# Altium schematic sheet final schematic.SchDoc
size 762 x 457 mm; SheetNumber: 1; SheetTotal: 1
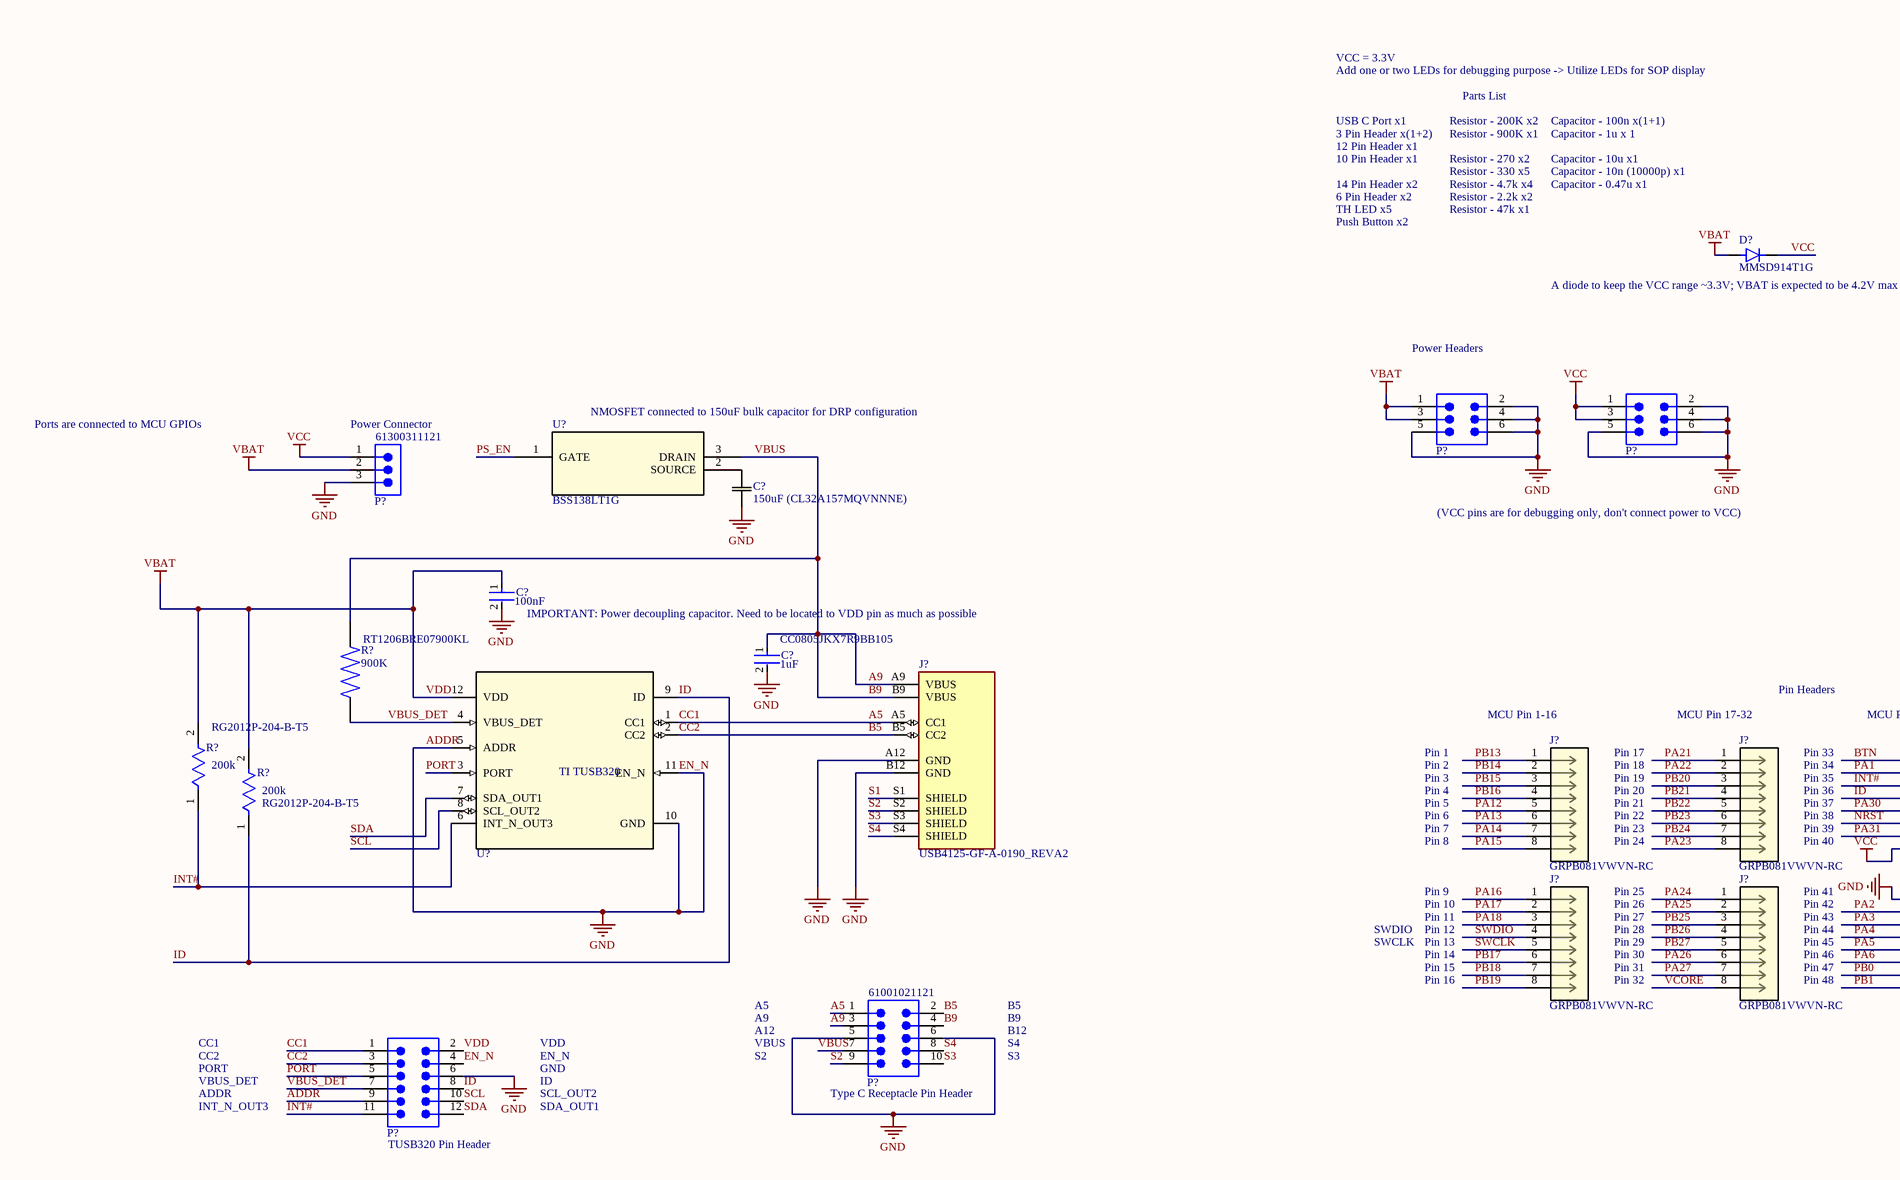
[diagram p0: final schematic.SchDoc, top left]
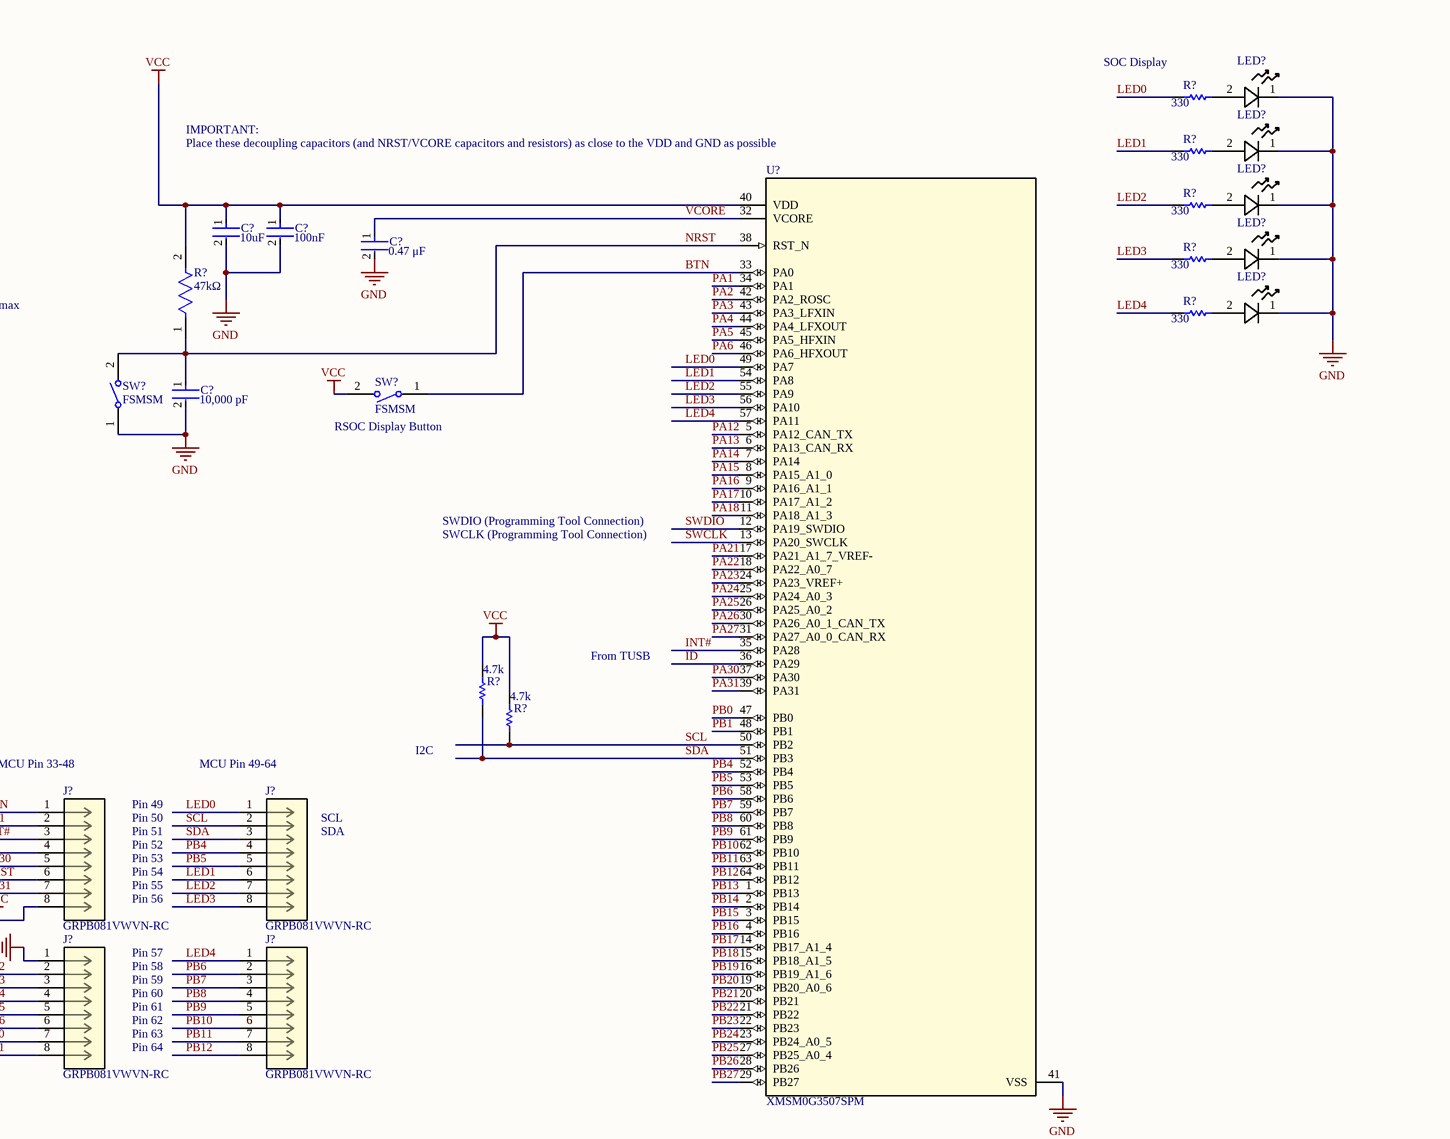
[diagram p1: final schematic.SchDoc, top right]
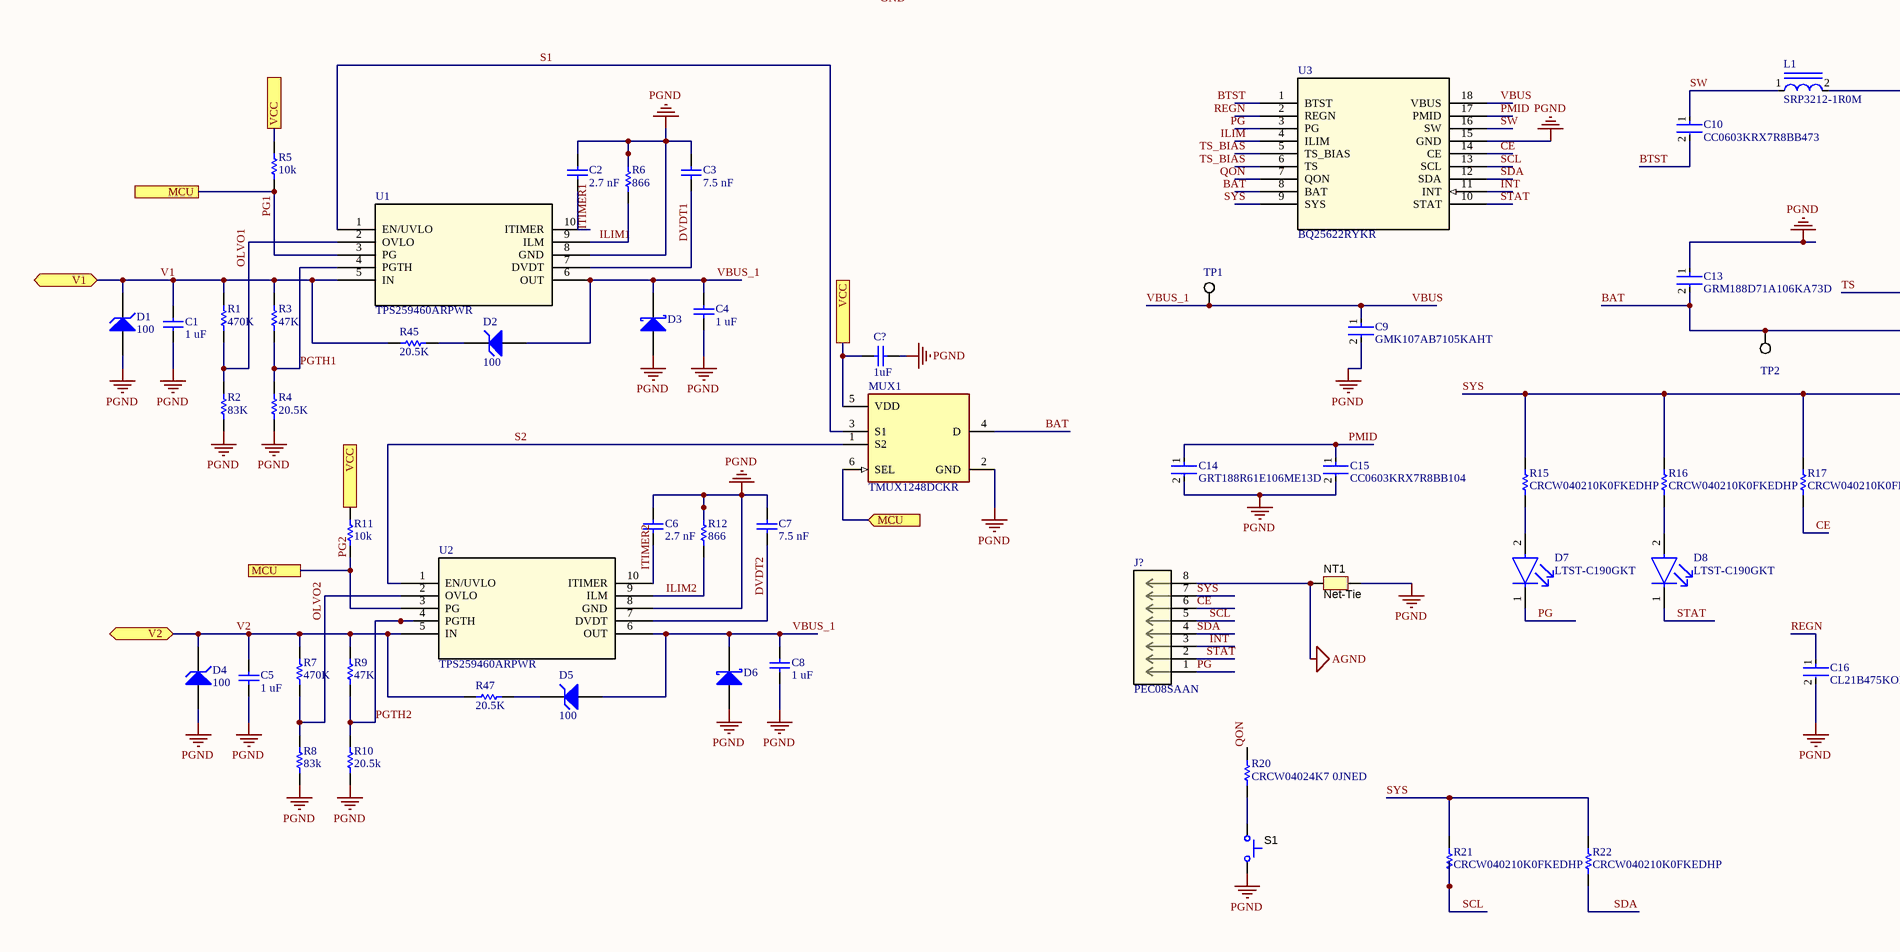
[diagram p2: final schematic.SchDoc, bottom left]
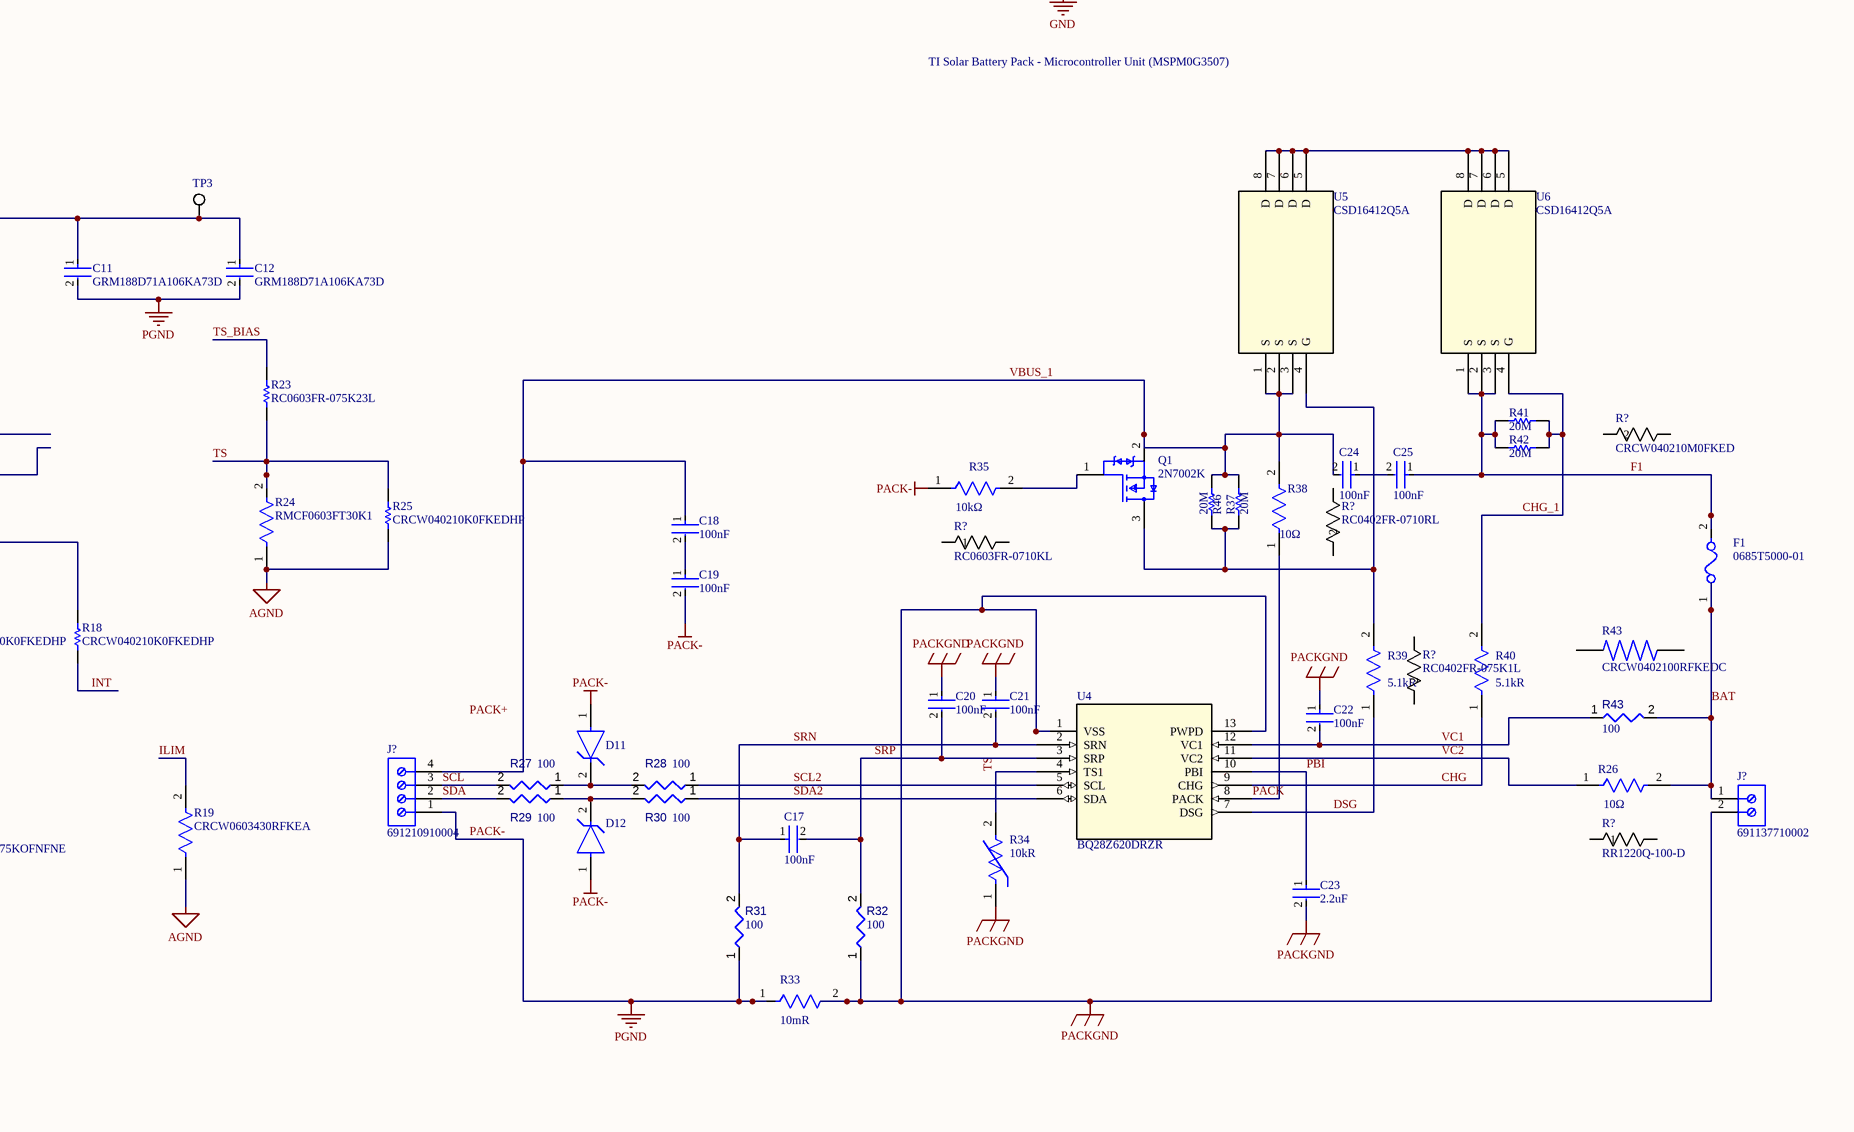
[diagram p3: final schematic.SchDoc, bottom right]

## Parts
(Parts that share a designator on the sheet are numbered #1, #2 ... from top to bottom, then left to right.)
C1  value 1 uF  (hidden comment: Capacitor)
C2  value 2.7 nF  (hidden comment: Capacitor)
C3  value 7.5 nF  (hidden comment: Capacitor)
C4  value 1 uF  (hidden comment: Capacitor)
C5  value 1 uF  (hidden comment: Capacitor)
C6  value 2.7 nF  (hidden comment: Capacitor)
C7  value 7.5 nF  (hidden comment: Capacitor)
C8  value 1 uF  (hidden comment: Capacitor)
C9  GMK107AB7105KAHT  [FP-0603-L_1_6_0_15-W_0_8-IPC_A]
C10  CC0603KRX7R8BB473  [FP-CC0603-DA-MFG]
C11  GRM188D71A106KA73D  [FP-GRM188-0_2-MFG]
C12  GRM188D71A106KA73D  [FP-GRM188-0_2-MFG]
C13  GRM188D71A106KA73D  [FP-GRM188-0_2-MFG]
C14  GRT188R61E106ME13D  [FP-GRT188-0_2-MFG]
C15  CC0603KRX7R8BB104  [FP-CC0603-DA-MFG]
C16  CL21B475KOFNFNE  [FP-CL21-IPC_B]
C17  Capacitance: 100nF  [FP-0805-L_2_01_0_2-W_1_25-IPC_C]  (hidden comment: 08055C104KAT2A)
C18  Capacitance: 100nF  [FP-0805-L_2_01_0_2-W_1_25-IPC_C]  (hidden comment: 08055C104KAT2A)
C19  Capacitance: 100nF  [FP-0805-L_2_01_0_2-W_1_25-IPC_C]  (hidden comment: 08055C104KAT2A)
C20  Capacitance: 100nF  [FP-0805-L_2_01_0_2-W_1_25-IPC_C]  (hidden comment: 08055C104KAT2A)
C21  Capacitance: 100nF  [FP-0805-L_2_01_0_2-W_1_25-IPC_C]  (hidden comment: 08055C104KAT2A)
C22  Capacitance: 100nF  [FP-0805-L_2_01_0_2-W_1_25-IPC_C]  (hidden comment: 08055C104KAT2A)
C23  Capacitance: 2.2uF  [FP-0805-L_2_01_0_2-W_1_25-IPC_B]  (hidden comment: 0805ZD225KAT2A)
C24  Capacitance: 100nF  [FP-0805-L_2_01_0_2-W_1_25-IPC_C]  (hidden comment: 08055C104KAT2A)
C25  Capacitance: 100nF  [FP-0805-L_2_01_0_2-W_1_25-IPC_C]  (hidden comment: 08055C104KAT2A)
C?#1  Capacitance: 10uF  [FP-C0805C106J8RACAUTO-MFG]  (hidden comment: C0805C106J8RACAUTO)
C?#2  Capacitance: 100nF  [FP-GRMJN6-0_1-MFG]  (hidden comment: GRMJN65C1H104GE01J)
C?#3  value 0.47 μF  [FP-C0603C-CF-MFG]  (hidden comment: C0603C474J4RACTU)
C?#4  value 10,000 pF  [FP-C0603C-CF-MFG]  (hidden comment: C0603C103J5RACTU)
C?#5  150uF (CL32A157MQVNNNE)  [CAP_CL32_SAM]
C?#6  Capacitance: 100nF  [FP-GRMJN6-0_1-MFG]  (hidden comment: GRMJN65C1H104GE01J)
C?#7  CC0805JKX7R9BB105  Capacitance: 1uF  [FP-CC0805-0_2-1_45-MFG]
C?#8  value 1uF  (hidden comment: Capacitor)
D1  BV: 100  (hidden comment: Zener Diode)
D2  BV: 100  (hidden comment: Zener Diode)
D3  Schottky Diode  (value not drawn)
D4  BV: 100  (hidden comment: Zener Diode)
D5  BV: 100  (hidden comment: Zener Diode)
D6  Schottky Diode  (value not drawn)
D7  LTST-C190GKT  [FP-LTST-C190GKT-MFG]
D8  LTST-C190GKT  [FP-LTST-C190GKT-MFG]
D11  MM3Z5V6C  [FP-SOD-323F-MFG]  (value not drawn)
D12  MM3Z5V6C  [FP-SOD-323F-MFG]  (value not drawn)
D?  MMSD914T1G  [DIO_MMSD914T1G]
F1  0685T5000-01  [FP-0685T-MFG]
J?#1  USB4125-GF-A-0190_REVA2  [GCT_USB4125-GF-A-0190_REVA2]
J?#2  GRPB081VWVN-RC  [CONN8_VWVN-RC_SUL]
J?#3  GRPB081VWVN-RC  [CONN8_VWVN-RC_SUL]
J?#4  GRPB081VWVN-RC  [CONN8_VWVN-RC_SUL]
J?#5  GRPB081VWVN-RC  [CONN8_VWVN-RC_SUL]
J?#6  GRPB081VWVN-RC  [CONN8_VWVN-RC_SUL]
J?#7  GRPB081VWVN-RC  [CONN8_VWVN-RC_SUL]
J?#8  GRPB081VWVN-RC  [CONN8_VWVN-RC_SUL]
J?#9  GRPB081VWVN-RC  [CONN8_VWVN-RC_SUL]
J?#10  691137710002  [691137710002]
J?#11  691210910004  [691210910004]
J?#12  PEC08SAAN  [CONN_xxC08SAAN_SUL]
L1  SRP3212-1R0M  [FP-SRP3212-MFG]
LED?#1  LTW-420D7  [LED_LTW-420D7_LTO]  (value not drawn)
LED?#2  LTW-420D7  [LED_LTW-420D7_LTO]  (value not drawn)
LED?#3  LTW-420D7  [LED_LTW-420D7_LTO]  (value not drawn)
LED?#4  LTW-420D7  [LED_LTW-420D7_LTO]  (value not drawn)
LED?#5  LTW-420D7  [LED_LTW-420D7_LTO]  (value not drawn)
MUX1  TMUX1248DCKR  [FP-DCK0006A-IPC_B]
NT1  Net-Tie  [Net-Tie_20milWide_60milLong]  (net tie, no BOM)
P?#1  61000621121  [61000621121]  (value not drawn)
P?#2  61000621121  [61000621121]  (value not drawn)
P?#3  61300311121  [61300311121]
P?#4  61001021121  [61001021121]
P?#5  61001221121  [61001221121]  (value not drawn)
Q1  2N7002K  [FP-318-08-MFG]
R1  value 470K  (hidden comment: Resistor)
R2  value 83K  (hidden comment: Resistor)
R3  value 47K  (hidden comment: Resistor)
R4  value 20.5K  (hidden comment: Resistor)
R5  value 10k  (hidden comment: Resistor)
R6  value 866  (hidden comment: Resistor)
R7  value 470K  (hidden comment: Resistor)
R8  value 83k  (hidden comment: Resistor)
R9  value 47K  (hidden comment: Resistor)
R10  value 20.5k  (hidden comment: Resistor)
R11  value 10k  (hidden comment: Resistor)
R12  value 866  (hidden comment: Resistor)
R15  CRCW040210K0FKEDHP  [RESC1005X40X25ML05T10]
R16  CRCW040210K0FKEDHP  [RESC1005X40X25ML05T10]
R17  CRCW040210K0FKEDHP  [RESC1005X40X25ML05T10]
R18  CRCW040210K0FKEDHP  [RESC1005X40X25ML05T10]
R19  CRCW0603430RFKEA  [FP-CRCW0603-e3-IPC_B]
R20  CRCW04024K7 0JNED  [RESC1005X40X25ML05T10]
R21  CRCW040210K0FKEDHP  [RESC1005X40X25ML05T10]
R22  CRCW040210K0FKEDHP  [RESC1005X40X25ML05T10]
R23  RC0603FR-075K23L  [RESC1608X55X25NL10T15]
R24  RMCF0603FT30K1  [FP-RMCF0603-IPC_A]
R25  CRCW040210K0FKEDHP  [RESC1005X40X25ML05T10]
R26  Resistance: 10Ω  [FP-PR01-MFG]  (hidden comment: PR01000101009JR500)
R27  value 100  [RESA60-630X240]  (hidden comment: MFR-25FBF52-100R)
R28  value 100  [RESA60-630X240]  (hidden comment: MFR-25FBF52-100R)
R29  value 100  [RESA60-630X240]  (hidden comment: MFR-25FBF52-100R)
R30  value 100  [RESA60-630X240]  (hidden comment: MFR-25FBF52-100R)
R31  value 100  [RESA60-630X240]  (hidden comment: MFR-25FBF52-100R)
R32  value 100  [RESA60-630X240]  (hidden comment: MFR-25FBF52-100R)
R33  Resistance: 10mR  [FP-ERJ8BW-MFG]  (hidden comment: ERJ-8BWFR010V)
R34  Resistance: 10kR  [FP-NCP21-0_2-IPC_C]  (hidden comment: NCP21XV103J03RA)
R35  Resistance: 10kΩ  [FP-MRS25-MFG]  (hidden comment: MRS25000C1002FCT00)
R37  20M  [RESC2013X60X35LL10T20]
R38  Resistance: 10Ω  [FP-PR01-MFG]  (hidden comment: PR01000101009JR500)
R39  Resistance: 5.1kR  [FP-MFR-12-MFG]  (hidden comment: MFR-12FTF52-5K1)
R40  Resistance: 5.1kR  [FP-MFR-12-MFG]  (hidden comment: MFR-12FTF52-5K1)
R41  20M  [RESC2013X60X35LL10T20]
R42  20M  [RESC2013X60X35LL10T20]
R43#1  CRCW0402100RFKEDC  [RESC1005X35N]
R43#2  value 100  [RESA60-630X240]  (hidden comment: MFR-25FBF52-100R)
R45  value 20.5K  (hidden comment: Resistor)
R46  20M  [RESC2013X60X35LL10T20]
R47  value 20.5K  (hidden comment: Resistor)
R?#1  value 330  [RESC2013X60X40LL20T25]  (hidden comment: ERA6AEB331V)
R?#2  value 330  [RESC2013X60X40LL20T25]  (hidden comment: ERA6AEB331V)
R?#3  value 330  [RESC2013X60X40LL20T25]  (hidden comment: ERA6AEB331V)
R?#4  value 330  [RESC2013X60X40LL20T25]  (hidden comment: ERA6AEB331V)
R?#5  value 330  [RESC2013X60X40LL20T25]  (hidden comment: ERA6AEB331V)
R?#6  Resistance: 47kΩ  [FP-ERA6A-MFG]  (hidden comment: ERA-6AEB473V)
R?#7  value 4.7k  [RESC2013X60X40ML20T25]  (hidden comment: ERA6AEB472V)
R?#8  RT1206BRE07900KL  value 900K  [RESC3116X65N]
R?#9  value 4.7k  [RESC2013X60X40ML20T25]  (hidden comment: ERA6AEB472V)
R?#10  RG2012P-204-B-T5  Resistance: 200k  [FP-RG2012-IPC_B]
R?#11  RG2012P-204-B-T5  Resistance: 200k  [FP-RG2012-IPC_B]
R?#12  CRCW040210M0FKED  [RES_CRCW_0402]
R?#13  RC0603FR-0710KL  [RC0603N_YAG]
R?#14  RC0402FR-0710RL  [RC0402N_YAG]
R?#15  RC0402FR-075K1L  [RC0402N_YAG]
R?#16  RR1220Q-100-D  [RES_1220_SUS]
S1  KSR221GLFS  [KSR]  (value not drawn)
SW?#1  FSMSM  [TECO-FSMSM-2_V]
SW?#2  FSMSM  [TECO-FSMSM-2_V]
TP1  5002  [Keystone5002]  (value not drawn)
TP2  5002  [Keystone5002]  (value not drawn)
TP3  5002  [Keystone5002]  (value not drawn)
U1  TPS259460ARPWR  [TPS259460ARPWR_TEX]
U2  TPS259460ARPWR  [TPS259460ARPWR_TEX]
U3  BQ25622RYKR  [WQFN-HR18__RYK_TEX]
U4  BQ28Z620DRZR  [VSON12_DRZ_TEX]
U5  CSD16412Q5A  [DQJ8]
U6  CSD16412Q5A  [DQJ8]
U?#1  XMSM0G3507SPM  [PM0064A-IPC_A]
U?#2  BSS138LT1G  [SOT-23-3_1P4X3P040_ONS]
U?#3  TI TUSB320  [RWB0012A]

## Ports
MCU (in, see final schematic[1C], final schematic[1D]), MCU (see final schematic[1C], final schematic[2D]), MCU (see final schematic[1D], final schematic[2D]), V1 (bidir), V2 (bidir), VCC (see final schematic[1C], final schematic[1D]), VCC (see final schematic[1C], final schematic[2C]), VCC (see final schematic[1D], final schematic[2C])

## Nets
ADDR: C?#1.2 C?#2.2 C?#3.2 C?#4.2 C?#5.1 C?#6.2 C?#7.2 J?#1.A12(GND) J?#1.B12(GND) J?#8.1 LED?#1.1 LED?#2.1 LED?#3.1 LED?#4.1 LED?#5.1 P?#1.2 P?#1.4 P?#1.5 P?#1.6 P?#2.2 P?#2.4 P?#2.5 P?#2.6 P?#3.3 P?#4.5 P?#4.6 P?#5.4 P?#5.6 P?#5.9 SW?#2.1 U?#1.41(VSS) U?#3.5(ADDR) U?#3.10(GND) U?#3.11(EN_N)  [also labelled EN_N, GND]
AGND: J?#12.8 NT1.1 R19.1 R24.1 R25.1
PACK-: C1.2 C2.1 C3.1 C4.2 C5.2 C6.1 C7.1 C8.2 C9.2 C11.2 C12.2 C13.1 C14.2 C15.2 C16.2 C19.2 C?#8.1 D1.1(A) D3.1(A) D4.1(A) D6.1(A) D11.1(A) D12.1(A) J?#11.1 MUX1.2(GND) NT1.2 R2.1 R4.1 R6.1 R8.1 R10.1 R12.1 R31.1 R33.1 R35.1 S1.2 U1.8(GND) U2.8(GND) U3.15(GND)  [also labelled PGND]
PACKGND: C20.1 C21.1 C22.1 C23.2 J?#10.2 R32.1 R33.2 R34.1 U4.1(VSS) U4.13(PWPD)
VCC: C?#1.1 C?#2.1 D?.K J?#4.8 P?#2.1 P?#2.3 P?#3.1 R?#6.2 R?#7.2 R?#9.2 SW?#1.2 U?#1.40(VDD)
VDD: C?#6.1 D?.A P?#1.1 P?#1.3 P?#3.2 P?#5.2 R?#10.2 R?#11.2 U?#3.12(VDD)  [also labelled VBAT]
A5: J?#1.A5(CC1) P?#4.1 P?#5.1 U?#3.1(CC1)  [also labelled CC1]
A9: C4.1 C8.1 C9.1 C18.1 C24.2 C?#7.1 D2.1(A) D3.2(K) D5.1(A) D6.2(K) J?#1.A9(VBUS) J?#1.B9(VBUS) J?#11.4 P?#4.3 P?#4.4 P?#4.7 Q1.2(Source) R37.2 R38.2 R46.2 R?#8.2 TP1.1 U1.6(OUT) U2.6(OUT) U3.18(VBUS) U5.1(S) U5.2(S) U5.3(S) U?#2.3(DRAIN)  [also labelled B9, VBUS, VBUS_1]
B5: J?#1.B5(CC2) P?#4.2 P?#5.3 U?#3.2(CC2)  [also labelled CC2]
BAT: C13.2 F1.1 J?#10.1 MUX1.4(D) R26.2 R43#2.2 TP2.1 U3.8(BAT)
BTN: J?#4.1 SW?#1.1 U?#1.33(PA0)
BTST: C10.2 U3.1(BTST)
CE: J?#12.6 R17.1 U3.14(CE)
CHG: R40.1 U4.9(CHG)
CHG_1: R40.2 R41.1 R42.1 U6.4(G)
DSG: R39.1 U4.7(DSG)
DVDT1: C3.2 U1.7(DVDT)
DVDT2: C7.2 U2.7(DVDT)
F1: C25.1 F1.2 R41.2 R42.2 U6.1(S) U6.2(S) U6.3(S)
ID: J?#4.4 P?#5.8 R?#11.1 U?#1.36(PA29) U?#3.9(ID)
ILIM: R19.2 U3.4(ILIM)
ILIM1: R6.2 U1.9(ILM)
ILIM2: R12.2 U2.9(ILM)
INT: J?#12.3 R18.1 U3.11(INT)
INT#: J?#4.3 P?#5.11 R?#10.1 U?#1.35(PA28) U?#3.6(INT_N_OUT3)
ITIMER1: C2.2 U1.10(ITIMER)
ITIMER2: C6.2 U2.10(ITIMER)
LED0: J?#5.1 R?#1.1 U?#1.49(PA7)
LED1: J?#5.6 R?#2.1 U?#1.54(PA8)
LED2: J?#5.7 R?#3.1 U?#1.55(PA9)
LED3: J?#5.8 R?#4.1 U?#1.56(PA10)
LED4: J?#9.1 R?#5.1 U?#1.57(PA11)
NRST: C?#4.1 J?#4.6 R?#6.1 SW?#2.2 U?#1.38(RST_N)
OLVO1: R1.1 R2.2 U1.2(OVLO)
OLVO2: R7.1 R8.2 U2.2(OVLO)
PA1: J?#4.2 U?#1.34(PA1)
PA2: J?#8.2 U?#1.42(PA2_ROSC)
PA3: J?#8.3 U?#1.43(PA3_LFXIN)
PA4: J?#8.4 U?#1.44(PA4_LFXOUT)
PA5: J?#8.5 U?#1.45(PA5_HFXIN)
PA6: J?#8.6 U?#1.46(PA6_HFXOUT)
PA12: J?#2.5 U?#1.5(PA12_CAN_TX)
PA13: J?#2.6 U?#1.6(PA13_CAN_RX)
PA14: J?#2.7 U?#1.7(PA14)
PA15: J?#2.8 U?#1.8(PA15_A1_0)
PA16: J?#6.1 U?#1.9(PA16_A1_1)
PA17: J?#6.2 U?#1.10(PA17_A1_2)
PA18: J?#6.3 U?#1.11(PA18_A1_3)
PA21: J?#3.1 U?#1.17(PA21_A1_7_VREF-)
PA22: J?#3.2 U?#1.18(PA22_A0_7)
PA23: J?#3.8 U?#1.24(PA23_VREF+)
PA24: J?#7.1 U?#1.25(PA24_A0_3)
PA25: J?#7.2 U?#1.26(PA25_A0_2)
PA26: J?#7.6 U?#1.30(PA26_A0_1_CAN_TX)
PA27: J?#7.7 U?#1.31(PA27_A0_0_CAN_RX)
PA30: J?#4.5 U?#1.37(PA30)
PA31: J?#4.7 U?#1.39(PA31)
PACK: R38.1 U4.8(PACK)
PB0: J?#8.7 U?#1.47(PB0)
PB1: J?#8.8 U?#1.48(PB1)
PB4: J?#5.4 U?#1.52(PB4)
PB5: J?#5.5 U?#1.53(PB5)
PB6: J?#9.2 U?#1.58(PB6)
PB7: J?#9.3 U?#1.59(PB7)
PB8: J?#9.4 U?#1.60(PB8)
PB9: J?#9.5 U?#1.61(PB9)
PB10: J?#9.6 U?#1.62(PB10)
PB11: J?#9.7 U?#1.63(PB11)
PB12: J?#9.8 U?#1.64(PB12)
PB13: J?#2.1 U?#1.1(PB13)
PB14: J?#2.2 U?#1.2(PB14)
PB15: J?#2.3 U?#1.3(PB15)
PB16: J?#2.4 U?#1.4(PB16)
PB17: J?#6.6 U?#1.14(PB17_A1_4)
PB18: J?#6.7 U?#1.15(PB18_A1_5)
PB19: J?#6.8 U?#1.16(PB19_A1_6)
PB20: J?#3.3 U?#1.19(PB20_A0_6)
PB21: J?#3.4 U?#1.20(PB21)
PB22: J?#3.5 U?#1.21(PB22)
PB23: J?#3.6 U?#1.22(PB23)
PB24: J?#3.7 U?#1.23(PB24_A0_5)
PB25: J?#7.3 U?#1.27(PB25_A0_4)
PB26: J?#7.4 U?#1.28(PB26)
PB27: J?#7.5 U?#1.29(PB27)
PBI: C23.1 U4.10(PBI)
PG: D7.1(C) J?#12.1 U3.3(PG)
PG1: MUX1.6(SEL) R5.2 R11.2 U1.3(PG) U2.3(PG) ; port MCU  [also labelled PG2]
PGTH1: R3.1 R4.2 U1.4(PGTH)
PGTH2: R9.1 R10.2 U2.4(PGTH)
PMID: C14.1 C15.1 U3.17(PMID)
PORT: P?#5.5 U?#3.3(PORT)
PS_EN: U?#2.1(GATE)
QON: R20.2 U3.7(QON)
REGN: C16.1 U3.2(REGN)
S1: J?#1.S1(SHIELD) MUX1.3(S1) U1.1(EN/UVLO)
S2: J?#1.S2(SHIELD) MUX1.1(S2) P?#4.9 U2.1(EN/UVLO)
S3: J?#1.S3(SHIELD) P?#4.10
S4: J?#1.S4(SHIELD) P?#4.8
SCL: J?#5.2 J?#11.3 J?#12.5 P?#5.10 R21.1 R27.2 R?#9.1 U3.13(SCL) U?#1.50(PB2) U?#3.8(SCL_OUT2)
SCL2: R28.1 U4.5(SCL)
SDA: J?#5.3 J?#11.2 J?#12.4 P?#5.12 R22.1 R29.2 R?#7.1 U3.12(SDA) U?#1.51(PB3) U?#3.7(SDA_OUT1)
SDA2: R30.1 U4.6(SDA)
SRN: C17.1 C21.2 R31.2 U4.2(SRN)
SRP: C17.2 C20.2 R32.2 U4.3(SRP)
STAT: D8.1(C) J?#12.2 U3.10(STAT)
SW: C10.1 L1.1 U3.16(SW)
SWCLK: J?#6.5 U?#1.13(PA20_SWCLK)
SWDIO: J?#6.4 U?#1.12(PA19_SWDIO)
SYS: J?#12.7 R15.2 R16.2 R17.2 R18.2 R21.2 R22.2 U3.9(SYS)
TS: R23.1 R24.2 R25.2 R34.2 U4.4(TS1)
TS_BIAS: R23.2 U3.5(TS_BIAS) U3.6(TS)
V1: C1.1 D1.2(K) R1.2 R3.2 R45.1 U1.5(IN) ; port V1
V2: C5.1 D4.2(K) R7.2 R9.2 R47.1 U2.5(IN) ; port V2
VBUS_DET: P?#5.7 R?#8.1 U?#3.4(VBUS_DET)
VC1: C22.2 R43#2.1 U4.12(VC1)
VC2: R26.1 U4.11(VC2)
VCC: C?#8.2 MUX1.5(VDD) R5.1 R11.1 ; port VCC  [a separate net that carries the same name]
VCORE: C?#3.1 J?#7.8 U?#1.32(VCORE)
NetC11_1: C11.1 C12.1 L1.2 TP3.1
NetC18_2: C18.2 C19.1
NetC24_1: C24.1 C25.2
NetC?#5_2: C?#5.2 U?#2.2(SOURCE)
NetD2_2: D2.2(K) R45.2
NetD5_2: D5.2(K) R47.2
NetD7_2: D7.2(A) R15.1
NetD8_2: D8.2(A) R16.1
NetD11_2: D11.2(C) R27.1 R28.2
NetD12_2: D12.2(C) R29.1 R30.2
NetLED?#1_2: LED?#1.2 R?#1.2
NetLED?#2_2: LED?#2.2 R?#2.2
NetLED?#3_2: LED?#3.2 R?#3.2
NetLED?#4_2: LED?#4.2 R?#4.2
NetLED?#5_2: LED?#5.2 R?#5.2
NetQ1_1: Q1.1(Gate) R35.2
NetQ1_3: Q1.3(Drain) R37.1 R39.2 R46.1 U5.4(G)
NetR20_1: R20.1 S1.1
NetU5_5: U5.5(D) U5.6(D) U5.7(D) U5.8(D) U6.5(D) U6.6(D) U6.7(D) U6.8(D)

Not connected (* = marked no-connect by the designer): R43#1 1 2; R?#12 1 2; R?#13 1 2; R?#14 1 2; R?#15 1 2; R?#16 1 2

## Notes on the sheet
- Add one or two LEDs for debugging purpose -> Utilize LEDs for SOP display
- VCC = 3.3V
- (near R?#1) SOC Display
- USB C Port x1
- 3 Pin Header x(1+2)
- 12 Pin Header x1
- Resistor - 200K x2
- Resistor - 900K x1
- Parts List
- Capacitor - 100n x(1+1)
- Capacitor - 1u x 1
- Place these decoupling capacitors (and NRST/VCORE capacitors and resistors) as close to the VDD and GND as possible
- IMPORTANT:
- 10 Pin Header x1
- 14 Pin Header x2
- 6 Pin Header x2
- TH LED x5
- Resistor - 270 x2
- Resistor - 330 x5
- Resistor - 4.7k x4
- Resistor - 2.2k x2
- Resistor - 47k x1
- Capacitor - 10u x1
- Capacitor - 10n (10000p) x1
- Capacitor - 0.47u x1
- Push Button x2
- (near D?) A diode to keep the VCC range ~3.3V; VBAT is expected to be 4.2V max
- Power Headers
- (near SW?#1) RSOC Display Button
- Ports are connected to MCU GPIOs
- (near P?#3) Power Connector
- (near U?#2) NMOSFET connected to 150uF bulk capacitor for DRP configuration
- (VCC pins are for debugging only, don't connect power to VCC)
- SWCLK (Programming Tool Connection)
- SWDIO (Programming Tool Connection)
- (near C?#6) IMPORTANT: Power decoupling capacitor. Need to be located to VDD pin as much as possible
- From TUSB
- (near J?#2) MCU Pin 1-16
- (near J?#3) MCU Pin 17-32
- Pin Headers
- (near J?#4) MCU Pin 33-48
- (near J?#5) MCU Pin 49-64
- I2C
- Pin 1
- Pin 2
- Pin 3
- Pin 17
- Pin 18
- Pin 19
- Pin 33
- Pin 34
- Pin 35
- Pin 49
- Pin 50
- Pin 51
- SCL
- SDA
- Pin 4
- Pin 5
- Pin 6
- Pin 7
- Pin 8
- Pin 20
- Pin 21
- Pin 22
- Pin 23
- Pin 24
- Pin 36
- Pin 37
- Pin 38
- Pin 39
- Pin 40
- Pin 52
- Pin 53
- Pin 54
- Pin 55
- Pin 56
- Pin 9
- Pin 10
- Pin 25
- Pin 26
- Pin 41
- Pin 42
- Pin 57
- Pin 58
- SWDIO
- SWCLK
- Pin 11
- Pin 12
- Pin 13
- Pin 14
- Pin 15
- Pin 27
- Pin 28
- Pin 29
- Pin 30
- Pin 31
- Pin 43
- Pin 44
- Pin 45
- Pin 46
- Pin 47
- Pin 59
- Pin 60
- Pin 61
- Pin 62
- Pin 63
- A5
- A9
- A12
- B5
- B9
- B12
- Pin 16
- Pin 32
- Pin 48
- Pin 64
- CC1
- CC2
- PORT
- VBUS_DET
- ADDR
- VDD
- EN_N
- GND
- ID
- SCL_OUT2
- VBUS
- S2
- (near P?#4) Type C Receptacle Pin Header
- S4
- S3
- TI Solar Battery Pack - Microcontroller Unit (MSPM0G3507)
- INT_N_OUT3
- (near P?#5) TUSB320 Pin Header
- SDA_OUT1
- Labels drawn without touching a wire or pin: PACK+

## Library data of the parts
C1-C8 C?#8 = Capacitor: SimulationGenericComponent: True
C9 = CMP-14477-000207-2: None; Dielectric: X7R; Voltage Rating: 35V; Capacitance: 1uF; Tolerance: 10%; Termination: SMD/SMT; Packaging: Tape and Reel; Case/Package: 0603; Ratings: AEC-Q200; Case Code (Metric): 1608; Height: 0.8mm; Halogen Free: Halogen Free; Lead Free: Lead Free; Min Operating Temperature: -55°C; Length: 1.6mm; RoHS Compliant: Yes; Case Code (Imperial): 0603; Thickness: 0.035inch; Width: 0.031inch; Max Operating Temperature: 125°C; Package Quantity: 4000; Voltage Rating (DC): 35V; Mount: Surface Mount
C10 = CMP-03422-000723-2: CAP CER 0.047UF 25V X7R 0603; NexarPartId: 9289253; Tolerance: 10%; Capacitance: 47nF; Material: Ceramic; Case/Package: 0603; RoHS: Compliant; Mount: Surface Mount; Length: 1.6mm; Dielectric: X7R; Schedule B: 8532240020, 8532240020; Halogen Free: Halogen Free; Case Code (Metric): 1608; Height: 800µm; Composition: Ceramic; Packaging: Digi-Reel®; Case Code (Imperial): 0603; Depth: 800µm; Max Operating Temperature: 125°C; Termination: SMD/SMT; Lead Free: Lead Free; Width: 800µm; Min Operating Temperature: -55°C; Voltage Rating: 25V; REACH SVHC: No SVHC; Voltage Rating (DC): 25V; Number of Pins: 2; Thickness: 889µm; Radiation Hardening: No
C11-C13 = CMP-06035-014971-1: Chip Multilayer Ceramic Capacitors for General Purpose, 0603, 10uF, X7T, +22%/-33%, 10%, 10V; Length: 1.6mm; Dielectric: X7T; Voltage Rating (DC): 10V; Width: 800um; Capacitance: 10uF; Thickness: 800um; Tolerance: 10%
C14 = CMP-06035-032378-1: Multi-Layer Ceramic Capacitor 10uF 25V X5R ±20% 0603 Paper T/R; Thickness: 0.035inch; Case/Package: 0603; Capacitance: 10uF; Voltage Rating: 25V; Mount: Surface Mount; Packaging: Tape and Reel; Width: 0.031inch; Max Operating Temperature: 85°C; Case Code (Imperial): 0603; Ratings: AEC-Q200; Tolerance: 20%; Min Operating Temperature: -55°C; Case Code (Metric): 1608; Length: 0.063inch
C15 = CMP-03422-000234-1: CAP CER 0.1UF 25V X7R 0603; Manufacturer: YAGEO; Capacitance: 100 nF; Tolerance: 0.1; Temperature Coefficient: 15%; Material: Ceramic; Value: 100 nF; Category: Cap; ComponentLink2URL: http://www.yageo.com/documents/recent/UPY-GPHC_X7R_6.3V-to-50V_18.pdf; Voltage Rating: 25 V; ComponentLink2Description: Datasheet; RoHS: TRUE; Octopart: https://octopart.com/cc0603krx7r8bb104-yageo-8376534; Manufacturer Part Number: CC0603KRX7R8BB104; Mouser Description: CC Series 0603 0.1 uF 25 V ±10% Tolerance X7R SMT Multilayer Ceramic Capacitor; Device Class L2: Capacitors; Automotive: No; Temperature Range Low: -55°C; Lead Free: Yes; Temperature Range High: +125°C; Package: CC0603-DA; Temperature: -55°C to +125°C; Footprint Url: http://www.yageo.com/exep/pages/download/literatures/UPY-C_GEN_24.pdf; Height: 0.9mm; Voltage: 25 V; Temperature Characteristic: X7R; Device Class L3: Ceramic Capacitors; Digikey Description: CAP CER 0.1UF 25V X7R 0603; Device Class L1: Passive Components
C16 = CMP-13271-000612-1: CL21 Series 0805 4.7uF 16V ±10% Tolerance X7R Multilayer Ceramic Chip Capacitor; Width: 0.049inch; Case Code (Imperial): 0805; Packaging: Tape and Reel; Package Quantity: 1; Max Operating Temperature: 125°C; Dielectric: X7R; Case Code (Metric): 2012; Capacitance: 4.7uF; Mount: Surface Mount; Radiation Hardening: No; Length: 0.079inch; Voltage Rating: 16V; Height: 1.25mm; Case/Package: 0805; Thickness: 0.053inch; Tolerance: 10%; Min Operating Temperature: -55°C; Depth: 1.25mm
C17-C22 C24 C25 = CMP-2000-05016-2: General Purpose Ceramic Capacitor, 0805, 100nF, 10%, X7R, 0.15, 50V; Dissipation Factor: 2.5%; Insulation Resistance: 100GR; Voltage Rating (DC): 50V; Package Quantity: 4000; Tolerance: 10%; Voltage Rating: 50V; Dielectric: X7R; Case/Package: 0805; Lead Free: Lead Free; Dielectric Material: Ceramic; Thickness: 0.037inch; Weight: 0.001411oz; Max Operating Temperature: 125°C; REACH SVHC: No SVHC; Mount: Surface Mount; RoHS Compliant: Yes; Depth: 1.25mm; Height: 0.5mm; Case Code (Metric): 2012; Length: 2mm; Termination: Standard; Case Code (Imperial): 0805; Number of Pins: 2; Voltage: 50V; Radiation Hardening: No; Min Operating Temperature: -55°C; Width: 1.2mm; Series: MLCC X7R; Packaging: Cut Tape
C23 = CMP-2000-05810-2: General Purpose Ceramic Capacitor, 0805, 2.2uF, 10%, X5R, 15%, 10V; Insulation Resistance: 500MR; Dissipation Factor: 5%; Termination: SMD/SMT; Length: 2.01mm; Lead Free: Lead Free; Voltage: 10V; Height: 1.4mm; Contact Plating: Tin; Dielectric: X5R; Voltage Rating (DC): 10V; REACH SVHC: No SVHC; Voltage Rating: 10V; Depth: 1.25mm; Min Operating Temperature: -55°C; Tolerance: 10%; Case Code (Metric): 2012; Max Operating Temperature: 85°C; Radiation Hardening: No; Dielectric Material: Ceramic; Packaging: Tape and Reel; Construction: Flat; Case Code (Imperial): 0805; RoHS Compliant: Yes; Package Quantity: 1; Series: -; Size: 1.4mm; Number of Pins: 2; Width: 0.049inch; Mount: Surface Mount; Thickness: 0.055inch; Case/Package: 0805
C?#1 = CMP-03020-034708-1: CAP CER 10UF 10V X7R 0805; Tolerance: 5%; Mount: Surface Mount; Voltage Rating: 10V; Max Operating Temperature: 125°C; Min Operating Temperature: -55°C; Case/Package: 0805; RoHS Compliant: Yes; Packaging: Tape and Reel; Case Code (Imperial): 0805; Case Code (Metric): 2012; Ratings: AEC-Q200
C?#2 C?#6 = CMP-00260-135708738-1: GRMJN65C1H104GE01J Multilayer Ceramic Capacitor, 0.1 uF, 50 V, ± 2%, C0G (NP0), 0704 [1810 Metric]; Voltage Rating: 50V; Temperature Coefficient: 30ppm/°C; Material: Ceramic; Tolerance: 2%; Case/Package: 0704; NexarPartId: 135708738; Height: 650µm; Lifecycle Status: Production; Min Operating Temperature: -55°C; Max Operating Temperature: 125°C
C?#3 = CMP-1035-02699-3: CAP CER 0.47UF 16V X7R 0603; Manufacturer: KEMET; Tolerance: 0.05; Temperature Coefficient: 30ppm/°C; Material: Ceramic; Automotive Grade: Grade 1; Manufacturer Part Number: C0603C474J4RACTU; Lead Free: Yes; Temperature Range Low: -55°C; Height: 0.87mm; Automotive: Yes; Device Class L2: Capacitors; Temperature Characteristic: X7R; Capacitance: 0.47 μF; Octopart: https://octopart.com/c0603c474j4ractu-kemet-15711632; Temperature Range High: +125°C; Temperature: -55°C to +125°C; Voltage Rating: 16 V; Device Class L1: Passive Components; ComponentLink2URL: https://api.kemet.com/component-edge/download/datasheet/C0603C100J5GACAUTO.pdf; Device Class L3: Ceramic Capacitors; Digikey Description: CAP CER 0.47UF 16V X7R 0603; Category: Cap; ComponentLink2Description: Datasheet; RoHS: TRUE; Mouser Description: Multilayer Ceramic Capacitors MLCC - SMD/SMT .47UF 16V 5% 0603; Package: C0603C-CF
C?#4 = CMP-2006-03817-3: Capacitor; Ceramic; Cap; .010uF; Tol 5%; SMT; Vol-Rtg 50V; X7R; Tape and Reel; Manufacturer: KEMET; Automotive Grade: Grade 1; Temperature Coefficient: 30ppm/°C; Tolerance: 0.05; Device Class L1: Passive Components; Temperature Range High: +125°C; Lead Free: Yes; Digikey Description: Capacitor; Ceramic; Cap; .010uF; Tol 5%; SMT; Vol-Rtg 50V; X7R; Tape and Reel; Temperature Range Low: -55°C; Voltage Rating: 50 V; Device Class L2: Capacitors; Octopart: https://octopart.com/c0603c103j5ractu-kemet-91371; ComponentLink2URL: https://api.kemet.com/component-edge/download/datasheet/C0603C100J5GACAUTO.pdf; Temperature Characteristic: X7R; Height: 0.87mm; ComponentLink2Description: Datasheet; Category: Cap; Manufacturer Part Number: C0603C103J5RACTU; Temperature: -55°C to +125°C; Device Class L3: Ceramic Capacitors; Mouser Description: Capacitor; Ceramic; Cap; .010uF; Tol 5%; SMT; Vol-Rtg 50V; X7R; Tape and Reel; RoHS: TRUE; Package: C0603C-CF; Automotive: Yes; Material: Ceramic; Capacitance: 10,000 pF
C?#5 = CL32A157MQVNNNE: No Description Available; Mfr_Name: Samsung
C?#7 = CMP-03422-001528-1: CAP CER 1UF 50V X7R 0805; Tolerance: 5%; Max Operating Temperature: 125°C; Case/Package: 0805; Packaging: Cut Tape; Voltage Rating: 50V; Mount: Surface Mount; Case Code (Metric): 2012; Case Code (Imperial): 0805; Min Operating Temperature: -55°C
D1 D2 D4 D5 = Zener Diode: AF: 1; BV_MAX: 1e99; CJO: 0; EG: 1.11; FC: 0.5; IBV: 0.001; IS: 1e-14; MJSW: 0.33; NTUN: 30; TNOM: 27; XTI: 3; SimulationGenericComponent: True; CJP: 0; CTA: 0; CTP: 0; FCS: 0.5; FV_MAX: 1e99; IKF: 0; IKR: 0; ISR: 1e-14; JSW: 0; JTUN: 0; JTUNSW: 0; KEG: 1; KF: 0; LEVEL: 1; N: 1; NBV: 1; NR: 1; NS: 1; PHP: 1; RS: 0; TCV: 0; TLEV: 0; TLEVC: 0; TM1: 0; TM2: 0; TPB: 0; TPHP: 0; TRS: 0; TRS2: 0; TT: 0; TTT1: 0; TTT2: 0; VJ: 1; XTITUN: 3
D3 D6 = Schottky Diode: AF: 1; BV: 0; BV_MAX: 1e99; EG: 1.11; FC: 0.5; IBV: 0.001; IS: 1e-14; MJSW: 0.33; NTUN: 30; TNOM: 27; XTI: 3; SimulationGenericComponent: True; CJO: 0; CJP: 0; CTA: 0; CTP: 0; FCS: 0.5; FV_MAX: 1e99; IKF: 0; IKR: 0; ISR: 1e-14; JSW: 0; JTUN: 0; JTUNSW: 0; KEG: 1; KF: 0; LEVEL: 1; N: 1; NBV: 1; NR: 1; NS: 1; PHP: 1; RS: 0; TCV: 0; TLEV: 0; TLEVC: 0; TM1: 0; TM2: 0; TPB: 0; TPHP: 0; TRS: 0; TRS2: 0; TT: 0; TTT1: 0; TTT2: 0; VJ: 1; XTITUN: 3
D7 D8 = CMP-22017-000005-2: LED GREEN CLEAR CHIP SMD; Dominant Wavelength: 569nm; Reverse Voltage: 5V; Lens Color: Colorless; Viewing Angle: 130°; Voltage: 2V; Forward Current: 30mA; Power Dissipation: 100mW; Luminous Intensity: 6mcd; Number of LEDs: 1; Forward Voltage: 2.1V; Wavelength: 565nm; Test Current: 10mA; Min Operating Temperature: -55°C; Lens Style: Clear; Mount: Surface Mount; Width: 0.8mm; Packaging: Tape and Reel; Lens Transparency: Clear; Case Code (Metric): 1608; Depth: 0.8mm; Case Code (Imperial): 0603; Case/Package: 0603; Number of Pins: 2; Max Operating Temperature: 85°C; Lead Free: Lead Free; Number of Elements: 1; Length: 1.6mm; Height: 0.8mm; Package Quantity: 1; Power Rating: 100mW; Radiation Hardening: No; Illumination Color: Green; Color: Green
D11 D12 = CMP-07164-000002-1: DIODE ZENER 5.6V 200MW SOD323F; Manufacturer: ON Semiconductor; Max Junction Temp: +150°C; Max Zener Voltage: 5.88V; Max Reverse Leakage Current: 0.9uA; Reverse Voltage: 2V; Zener Impedance: 37Ω; Device Class L2: Diodes; ComponentLink2Description: Datasheet; RoHS: TRUE; Digikey Description: DIODE ZENER 5.6V 200MW SOD323F; Mouser Description: Zener Diodes Diode Zener 5.6V 200mW 5%; ComponentLink2URL: https://www.onsemi.com/pub/Collateral/MM3Z9V1C-D.pdf; Octopart: https://octopart.com/mm3z5v6c-on+semiconductor-84329899; Category: Diode; Package: SOD-323F; Height: 1mm; Lead Free: Yes; Power Dissipation: 200mW; Temperature Range High: +150°C; Device Class L3: Zener Diodes; Automotive: No; Manufacturer Part Number: MM3Z5V6C; Nom Zener Voltage: 5.6V; Temperature: to +150°C; Device Class L1: Discrete Semiconductors
D? = MMSD914T1G: Diode Standard 100 V 200mA (DC) Surface Mount SOD-123; MF: ON Semiconductor; SnapEDA_Link: https://www.snapeda.com/parts/MMSD914T1G/Onsemi/view-part/?ref=snap; Package: SOD-123-2 ON Semiconductor; Value: *; MP: MMSD914T1G; Check_prices: https://www.snapeda.com/parts/MMSD914T1G/Onsemi/view-part/?ref=eda
F1 = CMP-16042-000006-1: FUSE BOARD MNT 5A 63VAC/VDC 1206; RoHS Compliant: Yes
J?#1 = USB4125-GF-A-0190_REVA2: Type C Receptacle, Horizontal, SMT, For Power Charging Only; MF: Global Connector Technology; Price: None; Check_prices: https://www.snapeda.com/parts/USB4125-GF-A-0190/Global%20Connector%20Technology/view-part/6227012/?ref=eda; Package: None; Value: *; MP: USB4125-GF-A-0190; SnapEDA_Link: https://www.snapeda.com/parts/USB4125-GF-A-0190/Global%20Connector%20Technology/view-part/6227012/?ref=snap; Availability: No availability data
J?#2-J?#9 = GRPB081VWVN-RC: No Description Available; Mfr_Name: Sullins; RefDes: RefDes; Type: Type
J?#10 = CMP-1502-03324-2: NexarPartId: 78871135; Voltage Rating: 300V; Number of Contacts: 2; Current Rating: 16A; Lead Pitch: 5mm; Height: 11.6mm; Packaging: Box; RoHS: Non-Compliant; Contact Material: Nickel, Tin; Max Operating Temperature: 120°C; Number of Pins: 2; Min Operating Temperature: -30°C; Number of Rows: 1
J?#11 = CMP-1502-02458-2: NexarPartId: 105950651
J?#12 = PEC08SAAN: No Description Available; Mfr_Name: Sullins; Type: Headers, Male Pins; RefDes: RefDes
L1 = CMP-07248-000145-1: IND,3.2X2.5X1MM,1UH20%,5.5A,SHD
LED?#1-LED?#5 = LTW-420D7: No Description Available; Mfr_Name: LITE-ON
MUX1 = CMP-04892-000117-1: 3- LOW RON, 5-V, 2:1 (SPDT) GENE
NT1 = CMP-0078142-6: Single point connection between nets.; MountType: SMT; CompType: Net-Tie; Manufacturer: N/A; PackageReference: N/A; PartNumber: N/A; Library Reference: Net-Tie
P?#1 P?#2 = 61000621121: WR-PHD Pin Header, SMT, Vertical, pitch 2.54mm, 2 Row, 6P; Manufacturer: Wurth Elektronik; Contact Resistance: 20mOhm; Rated Current: 3A; Working Voltage: 250V; Withstanding Voltage: 500V; Manufacturer Part Number: 61000621121; Category: Board-to-Board Connectors; Match Code: WR-PHD; ComponentLink1Description: Website Link; ComponentLink1URL: https://www.we-online.com/redexpert/article/61000621121?ad; ComponentLink2Description: Datasheet Link; ComponentLink2URL: https://www.we-online.com/redexpert/spec/61000621121?ad; Mount: Surface Mount; Operating Temperature Max: 125°C; Operating Temperature Min: -40°C; Packaging: Tube; Gender: Pin Header; Number of Pins: 6; Number of Rows: 2; Orientation: Vertical; Pitch: 2.54mm
P?#3 = 61300311121: WR-PHD Pin Header, THT, Vertical, pitch 2.54mm, 1 Row, 3P; Manufacturer: Wurth Elektronik; Contact Resistance: 20mOhm; Rated Current: 3A; Working Voltage: 250V; Withstanding Voltage: 500V; Manufacturer Part Number: 61300311121; Category: Board-to-Board Connectors; Match Code: WR-PHD; ComponentLink1Description: Website Link; ComponentLink1URL: https://www.we-online.com/redexpert/article/61300311121?ad; ComponentLink2Description: Datasheet Link; ComponentLink2URL: https://www.we-online.com/redexpert/spec/61300311121?ad; Mount: Through Hole; Operating Temperature Max: 105°C; Operating Temperature Min: -40°C; Packaging: Bag; Gender: Pin Header; Number of Pins: 3; Number of Rows: 1; Orientation: Vertical; Pitch: 2.54mm
P?#4 = 61001021121: WR-PHD Pin Header, SMT, Vertical, pitch 2.54mm, 2 Row, 10P; Manufacturer: Wurth Elektronik; Contact Resistance: 20mOhm; Rated Current: 3A; Working Voltage: 250V; Withstanding Voltage: 500V; Manufacturer Part Number: 61001021121; Category: Board-to-Board Connectors; Match Code: WR-PHD; ComponentLink1Description: Website Link; ComponentLink1URL: https://www.we-online.com/redexpert/article/61001021121?ad; ComponentLink2Description: Datasheet Link; ComponentLink2URL: https://www.we-online.com/redexpert/spec/61001021121?ad; Mount: Surface Mount; Operating Temperature Max: 125°C; Operating Temperature Min: -40°C; Packaging: Tube; Gender: Pin Header; Number of Pins: 10; Number of Rows: 2; Orientation: Vertical; Pitch: 2.54mm
P?#5 = 61001221121: WR-PHD Pin Header, SMT, Vertical, pitch 2.54mm, 2 Row, 12P; Manufacturer: Wurth Elektronik; Contact Resistance: 20mOhm; Rated Current: 3A; Working Voltage: 250V; Withstanding Voltage: 500V; Manufacturer Part Number: 61001221121; Category: Board-to-Board Connectors; Match Code: WR-PHD; ComponentLink1Description: Website Link; ComponentLink1URL: https://www.we-online.com/redexpert/article/61001221121?ad; ComponentLink2Description: Datasheet Link; ComponentLink2URL: https://www.we-online.com/redexpert/spec/61001221121?ad; Mount: Surface Mount; Operating Temperature Max: 125°C; Operating Temperature Min: -40°C; Packaging: Tube; Gender: Pin Header; Number of Pins: 12; Number of Rows: 2; Orientation: Vertical; Pitch: 2.54mm
Q1 = CMP-07173-000009-1: MOSFET N-CH 60V 300MA SOT23; Manufacturer: ON Semiconductor; Turn Off Delay Time: 55.8ns; Max Forward Diode Voltage: 1.2V; Max Junction Temp: +150°C; Pulse Drain Current: 5A; Threshold Vgs Min: 1V; Depletion Mode: False; Drain To Source Resistance: 1.19Ω; Number Of N Channels: 1; Standoff Height: 0.01mm; Rthja Max: 417°C/W; Input Capacitace At Vds: 24.5pF @ 20V; Threshold Vgs Max: 2.3V; Turn On Delay Time: 12.2ns; Gate Charge At Vgs: 0.7nC @ 4.5V; Continuous Drain Current: 320mA; Transconductance: 0.53S; Power Dissipation: 300mW; Gate To Source Voltage: 20V; Typ Forward Diode Voltage: 0.8V; ComponentLink2URL: https://www.onsemi.com/pub/Collateral/2N7002K-D.pdf; RoHS: TRUE; Device Class L1: Discrete Semiconductors; ComponentLink2Description: Datasheet; Manufacturer Part Number: 2N7002K; Octopart: https://octopart.com/2n7002k-on+semiconductor-84408900; Device Class L3: MOSFETs; Mouser Description: N-Channel 60 V 2 Ohm SMT Enhancement Mode Field Effect Transistor SOT-23; Ipc Land Pattern Name: SOT95P240X100-3; Temperature Range High: +150°C; Temperature Range Low: -55°C; Lead Free: Yes; Height: 1.11mm; Package: 318-08; Footprint Url: https://www.onsemi.com/pub/Collateral/318-08.PDF; Temperature: -55°C to +150°C; Drain To Source Voltage: 60V; Device Class L2: Transistors; Drain To Source Breakdown Voltage: 60V; Digikey Description: MOSFET N-CH 60V 300MA SOT23; Number Of Channels: 1; Category: Trans; Automotive: No
R1-R12 R45 R47 = Resistor: TC1: 0; SimulationGenericComponent: True; TC2: 0
R15-R18 R21 R22 R25 = CMP-2002-03043-1: Manufacturer: Vishay Dale; Part Number: CRCW040210K0FKEDHP
R19 = CMP-1012-00468-3: RES Thick Film, 430Ω, 1%, 0.1W, 100ppm/°C, 0603; Power Rating: 100mW; Voltage Rating: 75V; Resistance: 430R; Radiation Hardening: No; Width: 0.033inch; Max Operating Temperature: 155°C; Height: 0.45mm; Temperature Coefficient: 100ppm/°C; Number of Terminations: 2; Package Quantity: 10; Composition: Thick Film; Mount: Surface Mount; Contact Plating: Tin; Tolerance: 1%; Voltage Rating (DC): 75V; Case/Package: 0603; Features: Automotive AEC-Q200; Case Code (Imperial): 0603; Depth: 0.85mm; Termination: SMD/SMT; Packaging: Tape and Reel; Min Operating Temperature: -55°C; Weight: 7.1E-05oz; Case Code (Metric): 1608; Number of Pins: 2; Military Standard: Not; Lead Free: Lead Free; Length: 1.55mm; Working Voltage: 75V; Max Power Dissipation: 100mW
R20 = CMP-2002-03043-1: Part Number: CRCW040210K0FKEDHP; Manufacturer: Vishay Dale
R23 = CMP-2000-04092-1: RES 5.23K OHM 1% 1/10W 0603; Manufacturer: Yageo; Part Number: RC0603FR-075K23L
R24 = CMP-26527-004251-1: 30.1kΩ ±1% 0.1W 0603 Thick Film Chip Resistor AEC-Q200 compliant; Temperature Coefficient: 100ppm/°C; Power Rating: 100mW; Resistance: 30.1kR; Height: 0.022inch; RoHS Compliant: Yes; Tolerance: 1%; Contact Plating: Tin; Depth: 0.8mm; Case Code (Metric): 1608; Max Power Dissipation: 100mW; Packaging: Tape and Reel; Case Code (Imperial): 0603; Series: RMCF; Military Standard: Not; Mount: Surface Mount; Number of Terminations: 2; Case/Package: 0603; Features: Automotive AEC-Q200; Width: 0.031inch; Construction: Rectangular; Resistor Type: Thick Film; Min Operating Temperature: -55°C; Length: 1.55mm; Radiation Hardening: No; Max Operating Temperature: 155°C
R26 R38 = CMP-00030-42467166-1: PR01000101009JR500 Fixed Resistor, Metal Film, 1W, 10ohm, 350V, 5% +/-Tol, 250ppm/Cel, Through Hole Mount; Lead Diameter: 580µm; Wire/Cable Diameter: 50µm; Temperature Coefficient: 250ppm/°C; Length: 8mm; Lead Free: Lead Free; Number of Pins: 2; Contact Plating: Tin; Packaging: Tape & Reel (TR); Diameter: 2.5mm; Termination: Axial; Max Operating Temperature: 155°C; Power Rating: 1W; Voltage Rating: 350V; Features: Automotive AEC-Q200, Flame Retardant Coating; Composition: Metal Film; Min Operating Temperature: -55°C; Max Power Dissipation: 1W; Number of Terminations: 2; RoHS: Compliant; NexarPartId: 42467166; Mount: Through Hole; Width: 2.5mm; Schedule B: 8533210090, 8533210090; Height: 2.5mm; Tolerance: 5%; Operating Supply Voltage: 350V; Voltage Rating (DC): 350V; Radiation Hardening: No; Weight: 211.997734mg; Case/Package: Axial; REACH SVHC: Unknown
R27-R32 R43#2 = CMP-009-00046-4: Axial Resistor, 100 Ohm, +/- 1%, 0.25 W, -55 to 155 degC, 2-Pin THD, RoHS, Bulk; Manufacturer: Yageo; Voltage Rating: 250V; Power: 250mW; Packaging: Bulk; Max Operating Temperature: 155°C; Mounting Technology: TH; Datasheet Version: Apr-13; Case/Package: Axial; RoHS Compliant: True; Package Description: 2-Pin Axial Lead, Dia 2.4 mm, Body Length 6.3 mm; Package Quantity: 200; Package Reference: MFR-25; Tolerance: 1%; Composition: CarbonFilm; Datasheet URL: http://www.yageo.com/documents/recent/Yageo%20LR_MFR_2013.pdf; Manufacturer URL: http://www.yageo.com/; Min Operating Temperature: -55°C
R33 = CMP-2003-00764-2: RES 0.01 OHM 1% 1W 1206; Temperature Coefficient: 200ppm/°C; Mount: Surface Mount; Package Quantity: 1; Construction: Rectangular; Technology: THICK FILM; Contact Plating: Tin; Length: 3.2mm; Features: Automotive AEC-Q200; Lead Free: Lead Free; Military Standard: Not; Resistance Tolerance: 1%; Case/Package: 1206; Width: 1.6mm; Case Code (Imperial): 1206; Max Operating Temperature: 155°C; Min Operating Temperature: -55°C; Max Power Dissipation: 1W; Tolerance: 1%; Height: 0.65mm; Termination: SMD/SMT; REACH SVHC: No SVHC; Radiation Hardening: No; Depth: 1.6mm; Series: ERJ; RoHS Compliant: Yes; Packaging: Tape and Reel; Number of Terminations: 2; Resistor Type: Thick Film; Size Code: 1206; Power Rating: 1W; Case Code (Metric): 3216
R34 = CMP-2000-06827-2: THERMISTOR NTC 10KOHM 3900K 0805; Accuracy: 3%; Current Rating: 440uA; Power Rating: 200mW; Tolerance: 5%; Number of Pins: 2; Termination: SMD/SMT; Lead Free: Lead Free; Radiation Hardening: No; Mount: Surface Mount; Case Code (Metric): 2012; Depth: 1.25mm; Max Operating Temperature: 125°C; Height: 0.85mm; Case Code (Imperial): 0805; Package Quantity: 4000; Length: 2mm; Case/Package: 0805; Min Operating Temperature: -40°C; Packaging: Tape and Reel; Max Power Dissipation: 200mW; Thickness: 150um; REACH SVHC: No SVHC
R35 = CMP-00030-42632392-1: MRS25000C1002FCT00 Resistor, 10 kOhm, ± 1%, 600 mW, Axial Leaded, Metal Film (Thin Film), Professional; Power Rating: 600mW; Voltage Rating (DC): 350V; Lead Length: 26mm; Temperature Coefficient: 50ppm/°C; Termination: Axial; Number of Terminations: 2; Diameter: 2.5mm; Composition: Metal Film, Thin Film; Number of Pins: 2; Length: 6.5mm; Military Standard: Not; RoHS: Compliant; NexarPartId: 42632392; Width: 2.5mm; Radiation Hardening: No; Voltage Rating: 350V; Max Power Dissipation: 600mW; Min Operating Temperature: -55°C; Lead Free: Lead Free; Max Operating Temperature: 155°C; Tolerance: 1%; Schedule B: 8533210090, 8533210090; Contact Plating: Tin; Mount: Through Hole; REACH SVHC: Unknown; Case/Package: Conformal
R37 R41 R42 R46 = CMP-2001-01355-1: Part Number: RC0805JR-0720ML; Manufacturer: Yageo
R39 R40 = CMP-03413-000008-1: RES MF 1/6W 1% AXIAL; Voltage Rating (DC): 200V; Lead Diameter: 0.5mm; Power Rating: 166mW; Temperature Coefficient: 100ppm/°C; Width: 3.4mm; Length: 1.9mm; Resistor Type: Metal Film; Packaging: Ammo Pack; Case/Package: Metal; Max Operating Temperature: 155°C; Mount: Through Hole; Series: MFR; Voltage Rating: 200V; Min Operating Temperature: -55°C; Termination: Axial; Tolerance: 1%
R43#1 = CRCW0402100RFKEDC: 100 Ohms Â±1% 0.063W, 1/16W Chip Resistor 0402 (1005 Metric) Thick Film; MF: Vishay; Package: 1005 Yageo; Purchase-URL: https://pricing.snapeda.com/search/part/CRCW0402100RFKEDC/?ref=eda; Check_prices: https://www.snapeda.com/parts/CRCW0402100RFKEDC/Vishay/view-part/4131527/?ref=eda; SnapEDA_Link: https://www.snapeda.com/parts/CRCW0402100RFKEDC/Vishay/view-part/4131527/?ref=snap; Digi-Key_Part_Number: 541-3962-1-ND; MP: CRCW0402100RFKEDC; Value: *
R?#1-R?#5 = CMP-2001-00628-1: Manufacturer: Panasonic; Part Number: ERA6AEB331V
R?#6 = CMP-2001-00645-2: NexarPartId: 1264112; Voltage Rating (DC): 100V; Max Power Dissipation: 125mW; Temperature Coefficient: 25ppm/°C; Tolerance: 0.1%; Case Code (Metric): 2012; Packaging: Cut Tape; Number of Terminations: 2; Max Operating Temperature: 155°C; Height: 500µm; Number of Pins: 2; Min Operating Temperature: -55°C; RoHS: Compliant; Features: Automotive AEC-Q200; Schedule B: 8533210045, 8533210045; Contact Plating: Tin; Case Code (Imperial): 0805; Lead Free: Lead Free; Lifecycle Status: Production; Termination: SMD/SMT; Weight: 5.499807mg; REACH SVHC: No SVHC; Voltage Rating: 100V; Mount: Surface Mount; Radiation Hardening: No; Military Standard: Not; Power Rating: 125mW; Length: 2mm; Depth: 1.25mm; Width: 1.25mm; Composition: Metal Film, Thin Film; Case/Package: 0805
R?#7 R?#9 = CMP-2001-00644-1: Manufacturer: Panasonic; Manufacturer Part Number: ERA-6AEB472V; Voltage Rating: 100V; Power Rating: 125mW; Tolerance: 0.1%; Temperature Coefficient: 25ppm/°C; Part Number: ERA6AEB472V; Supplier: Mouser; Supplier Part Number: 667-ERA-6AEB472V; RoHS: Yes; Category: Chip SMD Resistors; Stock: 30218; Pricing: 1=0.13, 10=0.075, 50=0.075, 100=0.068, 1000=0.047, 10000=0.034 (USD); Mounting Technology: Surface Mount; Case/Package: 0805; Pins: 2; Case Code (Metric): 2012; Case Code (Imperial): 0805; Contact Plating: Tin; Min Operating Temperature: -55°C; Max Operating Temperature: 155°C; Packaging: Tape and Reel; Package Quantity: 1; Resistor Type: Thin Film; Number of Terminations: 2; Termination: SMD/SMT; Max Power Dissipation: 125mW; Voltage Rating (DC): 100V; Features: Automotive AEC-Q200; Series: ERA-6A; Resistance Tolerance: 0.1%; Construction: Rectangular; Technology: METAL FILM; Length: 2mm; Width: 1.25mm; Height: 0.5mm; Depth: 1.25mm; Ratings: AEC-Q200; Reach SVHC Compliant: No; Military Standard: Not; Lead Free: Lead Free; RoHS Compliant: Yes; ComponentLink1URL: https://datasheet.ciiva.com/11811/0900766b80beefcc-11811885.pdf?src-supplier=Rs; ComponentLink1Description: https://datasheet.ciiva.com/11811/0900766b80beefcc-11811885.pdf?src-supplier=Rs; ComponentLink2URL: https://datasheet.ciiva.com/9195/aoa0000ce26-9195772.pdf?src-supplier=Avnet; ComponentLink2Description: https://datasheet.ciiva.com/9195/aoa0000ce26-9195772.pdf?src-supplier=Avnet; ComponentLink3URL: https://datasheet.ciiva.com/7830/485442-7830655.pdf?src-supplier=Element14; ComponentLink3Description: https://datasheet.ciiva.com/7830/485442-7830655.pdf?src-supplier=Element14; ComponentLink4URL: https://datasheet.ciiva.com/22743/485442-22743070.pdf?src-supplier=Element14; ComponentLink4Description: https://datasheet.ciiva.com/22743/485442-22743070.pdf?src-supplier=Element14; ComponentLink5URL: https://datasheet.ciiva.com/48425/era-eng-tds-48425609.pdf?src-supplier=Distrelec; ComponentLink5Description: https://datasheet.ciiva.com/48425/era-eng-tds-48425609.pdf?src-supplier=Distrelec; ComponentLink6URL: https://datasheet.ciiva.com/48536/era-eng-tds-48536668.pdf?src-supplier=Distrelec; ComponentLink6Description: https://datasheet.ciiva.com/48536/era-eng-tds-48536668.pdf?src-supplier=Distrelec; ComponentLink7URL: https://datasheet.ciiva.com/16395/aoa0000ce26-16395272.pdf?src-supplier=Future+Electronics; ComponentLink7Description: https://datasheet.ciiva.com/16395/aoa0000ce26-16395272.pdf?src-supplier=Future+Electronics
R?#10 R?#11 = CMP-2001-02831-2: Automotive Metal Thin Film Chip Resistor, 0805, 200kΩ, 0.1%, 25ppm/°C, 0.125W, 150V; Voltage Rating: 100V; Max Power Dissipation: 125mW; Power Rating: 100mW; Voltage Rating (DC): 150V; Resistor Type: Thin Film; Width: 1.25mm; Packaging: Tape and Reel; Temperature Coefficient: 25ppm/°C; Package Quantity: 5000; Case Code (Imperial): 0805; Length: 0.079inch; Min Operating Temperature: -55°C; Termination: SMD/SMT; RoHS Compliant: Yes; Tolerance: 0.1%; Series: RG; Number of Terminations: 2; Case/Package: 0805; Max Operating Temperature: 155°C; Lead Free: Lead Free; Height: 0.02inch; Case Code (Metric): 2012
R?#12 = CRCW040210M0FKED: No Description Available; Mfr_Name: Vishay
R?#13 = RC0603FR-0710KL: No Description Available; Mfr_Name: Yageo
R?#14 = RC0402FR-0710RL: No Description Available; Mfr_Name: Yageo
R?#15 = RC0402FR-075K1L: No Description Available; Mfr_Name: Yageo
R?#16 = RR1220Q-100-D: No Description Available; Mfr_Name: Susumu
S1 = CMP-0002170-2: Switch, Normally open, 2.3N force, 200k operations, SMD; Manufacturer: C&K Components; Circuit: SPST Switch; CurrentRating_mA: 1.001kA; PositionCount: 1; SwitchFunction: Off-Mom; VDC_V: 32V; PartNumber: KSR221GLFS; PackageReference: KSR; CompType: Switch; RoHS: Y; MountType: SMT; ComponentLink1Description: Datasheet URL; ComponentLink1URL: http://www.ck-components.com/14401/ksr_4feb.pdf/; Publisher: Texas Instruments; LatestRevisionDate: 2017-03-09; Orientation: Top Actuated
SW?#1 SW?#2 = CMP-2000-07511-1: FSMSM Push Button Switch, 50 mA, -35 to 85 degC, 2-Pin SMD, RoHS, Bulk; Manufacturer: TE Connectivity; Actuator Length: 1.07mm; Electrical Life: 20000Cycles; Actuator Material: Polyamide; Current Rating: 50mA; Illumination Type: Illuminated; Voltage Rating (DC): 24V; Contact Resistance: 100mOhm; Case\/Package: SMD/SMT; Operating Force: 180gf; Switch Travel: 0.25mm; Max Voltage Rating (DC): 12V; Throw Configuration: SPST; Packaging: LoosePiece; Max Operating Temperature: 85degC; ELV: Compliant; Package Description: 2-Pin Surface Mount Device, Body 6 x 3.5 mm, Pitch 9.19 mm; RoHSCompliant: true; Manufacturer URL: http://www.te.com/; Contact Plating: Silver; Contact Material: Brass; Mounting Technology: SurfaceMount; Contact Current Rating: 50mA; Datasheet Version: Rev. C2, 08/2014; Datasheet URL: http://www.te.com/commerce/DocumentDelivery/DDEController?Action=showdoc&DocId=Customer+Drawing%7F1437566-3%7FC2%7Fpdf%7FEnglish%7FENG_CD_1437566-3_C2_1437566_3_1_c.dwg.pdf%7F1437566-3; Mechanical Life: 20000Cycles; Package Reference: FSMSM; REACH SVHC: Unknown; Orientation: Straight; Min Operating Temperature: -35degC; Lead Free: LeadFree; Termination: GullWing; Package Quantity: 1000; Mount: SurfaceMount
TP1-TP3 = CMP-0055139-2: Test Point, Miniature, White, TH; Manufacturer: Keystone Electronics; CNHeader: FALSE; ContactFinish: Silver; CT: TRUE; Green_Lifecycle: Active; Green_REACh: Passed; PartNumber: 5002; PackageReference: White Miniature Testpoint; CompType: Test Point; RoHS: Y; MountType: TH; ComponentLink1Description: Datasheet URL; ComponentLink1URL: http://www.keyelco.com/userAssets/file/M60-2p60.pdf; Publisher: Texas Instruments; LatestRevisionDate: 26/05/2017; Supplier 1: Digi-Key; Supplier Part Number 1: 36-5002-ND; Supplier 2: Newark; Supplier Part Number 2: 82H9632; Supplier 3: Mouser; Supplier Part Number 3: 534-5002; Color: White; Green_EU RoHS-2: Passed; Green_EU RoHS: Passed
U1 U2 = TPS259460ARPWR: No Description Available; Mfr_Name: Texas Instruments; RefDes: RefDes; Type: Type
U3 = BQ25622RYKR: No Description Available; Mfr_Name: Texas Instruments; RefDes: RefDes; Type: Type
U4 = BQ28Z620DRZR: No Description Available; Mfr_Name: Texas Instruments; Type: Power Management; RefDes: RefDes
U5 U6 = CSD16412Q5A: No Description Available; Mfr_Name: Texas Instruments; RefDes: RefDes; Type: Type
U?#1 = XMSM0G3507SPM: No Description Available; Mfr_Name: Texas Instruments; TYPE: TYPE; RefDes: RefDes
U?#2 = BSS138LT1G: No Description Available; Mfr_Name: onsemi; RefDes: RefDes; Type: Type
U?#3 = TUSB320IRWBR: No Description Available; Mfr_Name: Texas Instruments; TYPE: TYPE; RefDes: RefDes
R?#8 = RT1206BRE07900KL: Package: None; Price: None; MP: RT1206BRE07900KL; Availability: Unavailable